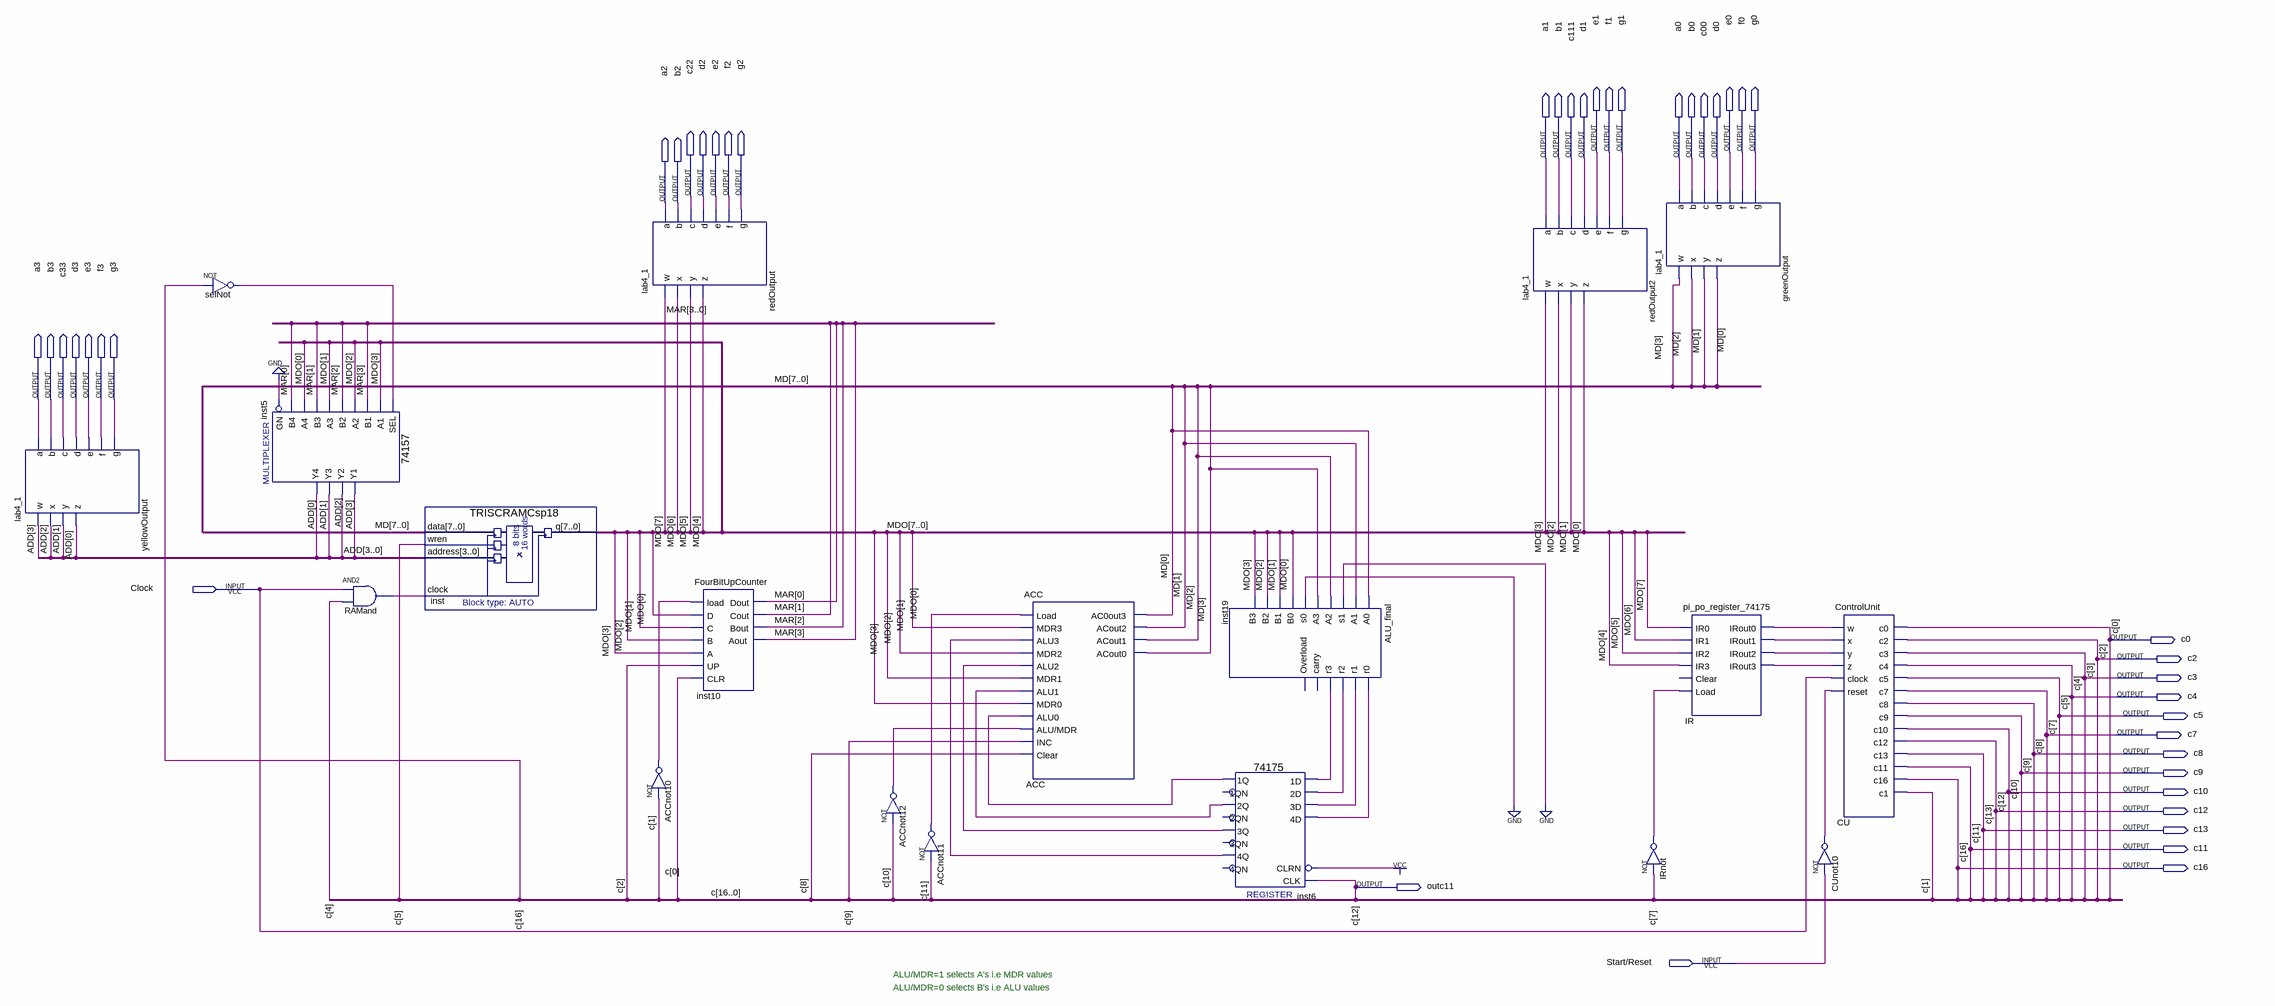
[diagram p0: schematic sheet]
// Quartus schematic final_c.bdf as structural Verilog: 19 symbols, 44 pins
module final_c (
  input  Clock,
  input  \Start/Reset ,
  output e1,
  output f1,
  output g1,
  output e0,
  output f0,
  output g0,
  output a1,
  output b1,
  output c111,
  output d1,
  output a0,
  output b0,
  output c00,
  output d0,
  output c22,
  output d2,
  output e2,
  output f2,
  output g2,
  output a2,
  output b2,
  output a3,
  output b3,
  output c33,
  output d3,
  output e3,
  output f3,
  output g3,
  output c0,
  output c2,
  output c3,
  output c4,
  output c5,
  output c7,
  output c8,
  output c9,
  output c10,
  output c12,
  output c13,
  output c11,
  output c16,
  output outc11
);

  wire ACCnot10_out, ACCnot11_out, ACCnot12_out, CUnot10_out, inst6_1q, inst6_2q, inst6_3q, inst6_4q,
       inst19_r0, inst19_r1, inst19_r2, inst19_r3, IR_irout0, IR_irout1, IR_irout2, IR_irout3, IRnot_out,
       RAMand_out, selNot_out;
  wire [1:1] c;
  wire [3:0] ADD, MAR;
  wire [7:0] MD, MDO;

  lab4_1 yellowOutput (
    .w(ADD[3]), .x(ADD[2]), .y(ADD[1]), .z(ADD[0]), .a(a3), .b(b3), .c(c33), .d(d3), .e(e3), .f(f3), .g(g3));
  not selNot (selNot_out, c16);
  \74157  inst5 (
    .A1(MDO[3]), .B1(MAR[3]), .SEL(selNot_out), .B2(MAR[2]), .A3(MDO[1]), .B3(MAR[1]), .A2(MDO[2]),
    .B4(MAR[0]), .GN(1'b0), .A4(MDO[0]), .Y2(ADD[2]), .Y1(ADD[3]), .Y4(ADD[0]), .Y3(ADD[1]));
  and RAMand (RAMand_out, Clock, c4);
  TRISCRAMCsp18 inst (.data(MD), .wren(c5), .address(ADD), .clock(RAMand_out), .q(MDO));
  lab4_1 redOutput (
    .w(MDO[7]), .x(MDO[6]), .y(MDO[5]), .z(MDO[4]), .a(a2), .b(b2), .c(c22), .d(d2), .e(e2), .f(f2), .g(g2));
  not ACCnot10 (ACCnot10_out, c[1]);
  FourBitUpCounter inst10 (
    .load(ACCnot10_out), .D(MDO[0]), .C(MDO[1]), .B(MDO[2]), .A(MDO[3]), .UP(c2), .CLR(c0), .Dout(MAR[0]),
    .Cout(MAR[1]), .Bout(MAR[2]), .Aout(MAR[3]));
  not ACCnot12 (ACCnot12_out, c10);
  not ACCnot11 (ACCnot11_out, c11);
  ACC ACC (
    .Load(ACCnot11_out), .MDR3(MDO[0]), .ALU3(inst6_4q), .MDR2(MDO[1]), .ALU2(inst6_3q), .MDR1(MDO[2]),
    .ALU1(inst6_2q), .MDR0(MDO[3]), .ALU0(inst6_1q), .\ALU/MDR (ACCnot12_out), .INC(c9), .Clear(c8),
    .AC0out3(MD[0]), .ACout2(MD[1]), .ACout1(MD[2]), .ACout0(MD[3]));
  ALU_final inst19 (
    .A0(MD[0]), .A1(MD[1]), .s1(1'b0), .A2(MD[2]), .A3(MD[3]), .s0(1'b0), .B0(MDO[0]), .B1(MDO[1]),
    .B2(MDO[2]), .B3(MDO[3]), .r0(inst19_r0), .r1(inst19_r1), .r2(inst19_r2), .r3(inst19_r3));  // open: carry, Overload
  \74175  inst6 (
    .CLRN(1'b1), .CLK(c12), .\3D (inst19_r1), .\2D (inst19_r2), .\1D (inst19_r3), .\4D (inst19_r0),
    .\1Q (inst6_1q), .\3Q (inst6_3q), .\2Q (inst6_2q), .\4Q (inst6_4q));  // open: 1QN, 2QN, 4QN, 3QN
  lab4_1 redOutput2 (
    .w(MDO[3]), .x(MDO[2]), .y(MDO[1]), .z(MDO[0]), .a(a1), .b(b1), .c(c111), .d(d1), .e(e1), .f(f1), .g(g1));
  lab4_1 greenOutput (
    .w(MD[3]), .x(MD[2]), .y(MD[1]), .z(MD[0]), .a(a0), .b(b0), .c(c00), .d(d0), .e(e0), .f(f0), .g(g0));
  pi_po_register_74175 IR (
    .IR0(MDO[7]), .IR1(MDO[6]), .IR2(MDO[5]), .IR3(MDO[4]), .Load(IRnot_out), .IRout0(IR_irout0),
    .IRout1(IR_irout1), .IRout2(IR_irout2), .IRout3(IR_irout3));  // open: Clear
  not IRnot (IRnot_out, c7);
  ControlUnit CU (
    .w(IR_irout0), .x(IR_irout1), .y(IR_irout2), .z(IR_irout3), .clock(Clock), .reset(CUnot10_out), .c0(c0),
    .c2(c2), .c3(c3), .c4(c4), .c5(c5), .c7(c7), .c8(c8), .c9(c9), .c10(c10), .c12(c12), .c13(c13),
    .c11(c11), .c16(c16), .c1(c[1]));
  not CUnot10 (CUnot10_out, \Start/Reset );

  assign outc11 = c12;

  // Notes on the sheet:
  //   ALU/MDR=1 selects A's i.e MDR values
  //   ALU/MDR=0 selects B's i.e ALU values
endmodule
